# Altium project EDA-02267-V6-1_project.PrjPCB (part 2 of 3)

## Sheet power_supply.SchDoc: Fine Delay FMC
size 297 x 209 mm; CheckedBy: B. Civel; CompanyName: CERN; DrawnBy: TW, GK; Engineer: TW; Organization: CERN; Address1: European Organization for Nuclear Research; Address2: CH-1211 Geneve 23 - Switzerland; DocumentNumber: 5; Revision: -; SheetNumber: 5; SheetTotal: 10; ModifiedBy: B. Civel; CreateDate: 18/01/2012; CheckedDate: 06/06/2013; Title2: Power supply & supervisor; Designer: TW, GK; EDA_Number: EDA-02267-V6-1; Projet: Fine Delay FMC (FMCDel1ns4cha); DivGrp: BE-CO; ModifiedDate: 16/08/2012
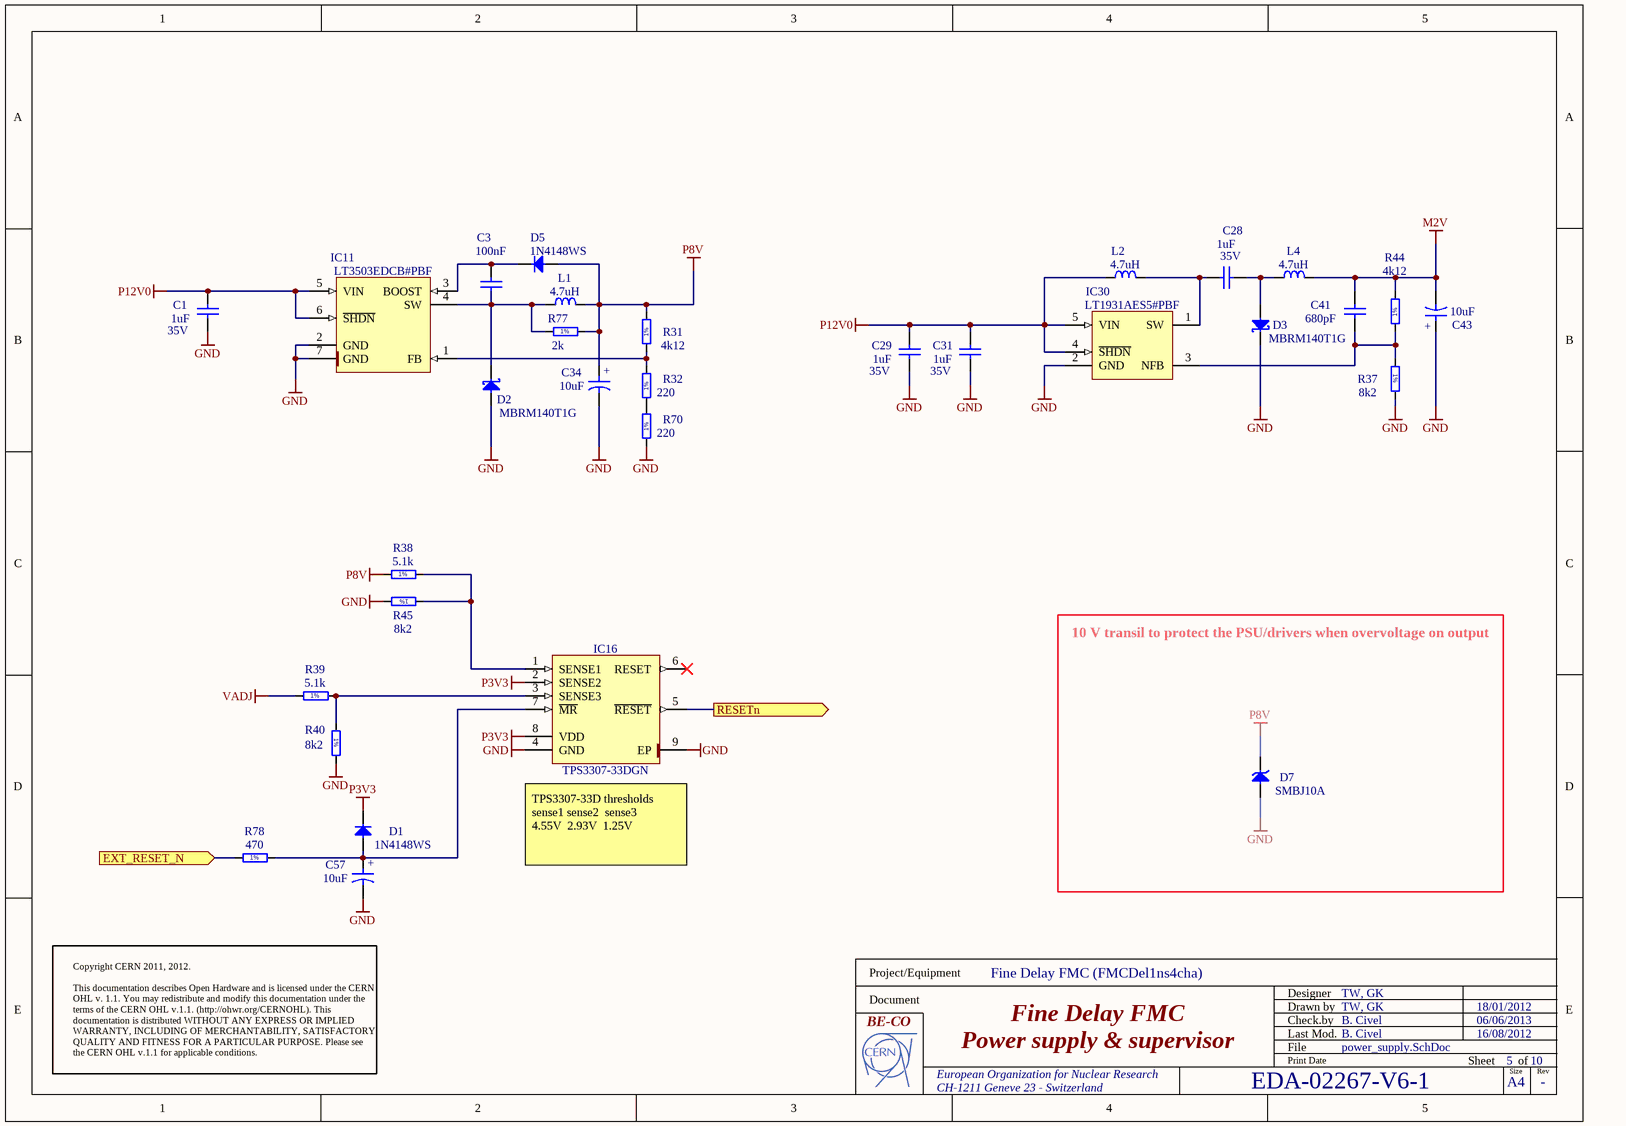
[diagram p3: power_supply.SchDoc]

### Parts
C1  1uF  Voltage: 35V  [CAPC2012X140N]
C3  100nF  [CAPC1608X87N]
C28  1uF  Voltage: 35V  [CAPC2012X140N]
C29  1uF  Voltage: 35V  [CAPC2012X140N]
C31  1uF  Voltage: 35V  [CAPC2012X140N]
C34  10uF  [CAPMP3528X210N]
C41  680pF  [CAPC1608X87N]
C43  10uF  [CAPMP3528X210N]
C57  10uF  [CAPMP3528X210N]
D1  1N4148WS  [SODFL2512X100N]
D2  MBRM140T1G  [ONSEMI_POWERMITE]
D3  MBRM140T1G  [ONSEMI_POWERMITE]
D5  1N4148WS  [SODFL2512X100N]
D7  SMBJ10A  [DIOM5336X265N]
IC11  LT3503EDCB#PBF  [SON50P300X200X80-7N-R175X145]
IC16  TPS3307-33DGN  [SOP65P490X110-9N-R157X189]
IC30  LT1931AES5#PBF  [SOT95P280X100-5N]
L1  4.7uH  [IND_TDK_VLCF5020-1]
L2  4.7uH  [IND_TDK_VLCF5020-1]
L4  4.7uH  [IND_TDK_VLCF5020-1]
R31  4k12  [RESC1608X55N]
R32  220  [RESC1608X55N]
R37  8k2  [RESC1608X55N]
R38  5.1k  [RESC1608X55N]
R39  5.1k  [RESC1608X55N]
R40  8k2  [RESC1608X55N]
R44  4k12  [RESC1608X55N]
R45  8k2  [RESC1608X55N]
R70  220  [RESC1608X55N]
R77  2k  [RESC1608X55N]
R78  470  [RESC1608X55N]

### Ports
EXT_RESET_N (in), RESETn (out)

### Nets
GND: C1.2 C29.2 C31.2 C34.2 C43.1 C57.2 D2.2(A) D3.1(C) D7.2(A) IC11.2(GND) IC11.7(GND) IC16.4(GND) IC16.9(EP) IC30.2(GND) R37.2 R40.2 R45.2 R70.1
M2V: C41.1 C43.2 L4.2 R44.2
P3V3: D1.1(C) IC16.2(SENSE2) IC16.8(VDD)
P8V: C34.1 D5.2(A) D7.1(C) L1.2 R31.2 R38.1 R77.2
P12V0: C1.1 C29.1 C31.1 IC11.5(VIN) IC11.6(~{SHDN}) IC30.4(~{SHDN}) IC30.5(VIN) L2.1
VADJ: R39.1
EXT_RESET_N: R78.1 ; port EXT_RESET_N
RESETn: IC16.5(~{RESET}) ; port RESETn
NetC3_1: C3.1 D2.1(C) IC11.4(SW) L1.1 R77.1
NetC3_2: C3.2 D5.1(C) IC11.3(BOOST)
NetC28_1: C28.1 D3.2(A) L4.1
NetC28_2: C28.2 IC30.1(SW) L2.2
NetC41_2: C41.2 IC30.3(NFB) R37.1 R44.1
NetC57_1: C57.1 D1.2(A) IC16.7(~{MR}) R78.2
NetIC11_1: IC11.1(FB) R31.1 R32.2
NetIC16_1: IC16.1(SENSE1) R38.2 R45.1
NetIC16_3: IC16.3(SENSE3) R39.2 R40.1
NetR32_1: R32.1 R70.2

Not connected (* = marked no-connect by the designer): IC16 6(RESET)*

### Notes on the sheet
- 10 V transil to protect the PSU/drivers when overvoltage on output
- (near IC16) TPS3307-33D thresholds
  sense1	sense2 	sense3
  4.55V 	2.93V 	1.25V
- Copyright CERN 2011, 2012.
  This documentation describes Open Hardware and is licensed under the CERN OHL v. 1.1. You may redistribute and modify this documentation under the terms of the CERN OHL v.1.1. (http://ohwr.org/CERNOHL). This documentation is distributed WITHOUT ANY EXPRESS OR IMPLIED WARRANTY, INCLUDING OF MERCHANTABILITY, SATISFACTORY QUALITY AND FITNESS FOR A PARTICULAR PURPOSE. Please see the CERN OHL v.1.1 for applicable conditions.
- Project/Equipment
- Document
- Designer
- Drawn by
- Check.by
- File
- Last Mod.
- Print Date
- Sheet
- Size
- A4
- of
- Rev
- (in symbol CTE3528-21_10UF_16V_20%_SANYO_TQC) +
- (in symbol R0603_2K_1%_0.1W_100PPM) 1%
- (in symbol R0603_4K12_1%_0.1W_100PPM) 1%
- (in symbol R0603_5K1_1%_0.1W_100PPM) 1%
- (in symbol R0603_8K2_1%_0.1W_100PPM) 1%
- (in symbol R0603_220R_1%_0.1W_100PPM) 1%
- (in symbol R0603_470R_1%_0.1W_100PPM) 1%

### Library data of the parts
C1 C28 C29 C31 = CC0805_1UF_35V_20%_X7R: Non-polarised capacitor; Part Description: SMD Multilayer Chip Ceramic Capacitor; Manufacturer: GENERIC; Manufacturer1 Part Number: GMK212B7105MG-T; TC: X7R; Tolerance: ±20%; Table: Capacitors SMD; Part Number: CC0805_1UF_35V_20%_X7R; Component Kind: Standard; Component Type: Standard; Pin Count: 2; Value: 1uF; Status: Not Recommended; Manufacturer Part Number: CC0805_1UF_35V_20%_X7R; Case: 0805; Mounted: Yes; Socket: No; SMD: Yes; Manufacturer1 Example: TAIYO YUDEN; Manufacturer1 ComponentHeight: 1.35mm; HelpURL: \\cern.ch\dfs\Applications\Altium\Datasheets\CC0805_X7R_TAIYO-YUDEN_HIGH-VALUE.pdf; Author: CERN DEM JLC; CreateDate: 22/06/2011; LatestRevisionDate: 22/06/2011
C3 = CC0603_100NF_50V_10%_X7R: as C12 on sheet clock_generator; Part Number: CC0603_100NF_50V_10%_X7R; Component Kind: Standard; Component Type: Standard; Pin Count: 2; Value: 100nF; Status: Preferred; Manufacturer Part Number: CC0603_100NF_50V_10%_X7R; Case: 0603; Mounted: Yes; Socket: No; SMD: Yes; Manufacturer1 Example: PHYCOMP; Manufacturer1 ComponentHeight: 0.87mm; HelpURL: \\cern.ch\dfs\Applications\Altium\Datasheets\CC0603_X7R_PHYCOMP.pdf; Author: CERN DEM JLC; CreateDate: 03/12/2007; LatestRevisionDate: 03/12/2007
C34 C43 C57 = CTE3528-21_10UF_16V_20%_SANYO_TQC: Polarised capacitor; Part Description: ESR 0R1 Solid Tantalum Chip Capacitor; Manufacturer: SANYO; Manufacturer Part Number: 16TQC10M; Voltage: 16V; Tolerance: ±20%; Table: Capacitors SMD; Part Number: CTE3528-21_10UF_16V_20%_SANYO_TQC; Component Kind: Standard; Component Type: Standard; Pin Count: 2; Value: 10uF; Status: Obsolete; Case: B; Mounted: Yes; Socket: No; SMD: Yes; ComponentHeight: 2.1mm; HelpURL: \\cern.ch\dfs\Applications\Altium\Datasheets\CTE_SANYO_TQC.pdf; Author: CERN DEM JLC; CreateDate: 29/06/2011; LatestRevisionDate: 01/09/2014
C41 = CC0603_680PF_50V_5%_NP0: Non-polarised capacitor; Part Description: SMD Multilayer Chip Ceramic Capacitor; Manufacturer: GENERIC; Manufacturer1 Part Number: 223886715681; Voltage: 50V; TC: C0G/NP0; Tolerance: ±5%; Table: Capacitors SMD; Part Number: CC0603_680PF_50V_5%_NP0; Component Kind: Standard; Component Type: Standard; Pin Count: 2; Value: 680pF; Status: Preferred; Manufacturer Part Number: CC0603_680PF_50V_5%_NP0; Case: 0603; Mounted: Yes; Socket: No; SMD: Yes; Manufacturer1 Example: PHYCOMP; Manufacturer1 ComponentHeight: 0.87mm; HelpURL: \\cern.ch\dfs\Applications\Altium\Datasheets\CC0603_NP0_PHYCOMP.pdf; Author: CERN DEM JLC; CreateDate: 03/12/2007; LatestRevisionDate: 03/12/2007
D1 D5 = 1N4148WS: Diode; Part Description: Small Signal Diodes; Manufacturer: FAIRCHILD SEMICONDUCTOR; Voltage: 75V; Power: 150mA; Table: Diodes; PressFit: No; Bonding: No; Part Number: 1N4148WS; Component Kind: Standard; Component Type: Standard; Device: 1N4148WS; PackageDescription: SODFL Diode; 1.70mm W X 1.25mm L X 1.00mm H body, IPC Medium Density; Manufacturer Part Number: 1N4148WS; Pin Count: 2; Case: SOD-323F; Mounted: Yes; Socket: No; SMD: Yes; ComponentHeight: 1mm; HelpURL: \\cern.ch\dfs\Applications\Altium\Datasheets\1N4148WS.pdf; Author: CERN DEM JLC; CreateDate: 12/05/2011; LatestRevisionDate: 12/05/2011
D2 D3 = MBRM140T1G: Schottky Diode; Part Description: Schottky Power Rectifier; Manufacturer: ON SEMICONDUCTOR; Voltage: 40V; Power: 1A; Table: Diodes; PressFit: No; Bonding: No; Part Number: MBRM140T1G; Component Kind: Standard; Component Type: Standard; Device: MBRM140T1G; PackageDescription: ON SEMICONDUCTOR POWERMITE Case, 2-Leads, Body 1.965 x 1.9mm; Manufacturer Part Number: MBRM140T1G; Pin Count: 2; Mounted: Yes; Socket: No; SMD: Yes; ComponentHeight: 1.15mm; HelpURL: \\cern.ch\dfs\Applications\Altium\Datasheets\MBRM140T1G.pdf; Author: CERN DEM JLC; CreateDate: 06/12/2011; LatestRevisionDate: 06/12/2011
D7 = SMBJ10A: Zener Diode; Part Description: Uni-Directional Transient Voltage Suppressor Diode; Manufacturer: FAIRCHILD SEMICONDUCTOR; Voltage: 10V; Power: 600W; Table: Diodes; PressFit: No; Bonding: No; Part Number: SMBJ10A; Component Kind: Standard; Component Type: Standard; Device: SMBJ10A; PackageDescription: DO-214-AA/SMB Diode, Molded Body; 5.34mm L X 3.625mm W X 2.65mm H, IPC Medium Density; Manufacturer Part Number: SMBJ10A; Pin Count: 2; Case: DO-214AA; Mounted: Yes; Socket: No; SMD: Yes; ComponentHeight: 2.65mm; HelpURL: \\cern.ch\dfs\Applications\Altium\Datasheets\SMBJ.pdf; Author: CERN DEM JLC; CreateDate: 19/12/2011; LatestRevisionDate: 19/12/2011
IC11 = LT3503EDCB#PBF: 1A, 2.2MHz Step-Down Switching Regulator; Manufacturer: LINEAR TECHNOLOGY; Table: Regulators; PressFit: No; Bonding: No; Part Number: LT3503EDCB#PBF; Component Kind: Standard; Component Type: Standard; Device: LT3503EDCB#PBF; PackageDescription: SON (DFN), 0.50mm pitch, 6 pin, 3mm X 2mm X 0.8mm H body (w/thermal tab 1.75 X 1.45mm),  IPC Medium Density; Part Description: 1A, 2.2MHz Step-Down Switching Regulator; Manufacturer Part Number: LT3503EDCB#PBF; Pin Count: 7; Case: SON6; Mounted: Yes; Socket: No; SMD: Yes; ComponentHeight: 0.8mm; HelpURL: \\cern.ch\dfs\Applications\Altium\Datasheets\LT3503EDCB#PBF.pdf; Author: CERN DEM JLC; CreateDate: 07/12/2011; LatestRevisionDate: 07/12/2011
IC16 = TPS3307-33DGN: Triple Processor Supervisors; Manufacturer: TEXAS INSTRUMENTS; Table: Analog & Interface; PressFit: No; Bonding: No; Part Number: TPS3307-33DGN; Component Kind: Standard; Component Type: Standard; Device: TPS3307-33DGN; PackageDescription: SOP,0.65mm,pitch; 8 pin,3.00mm W X 3.00mm L X 1.10mm H body (w/thermal tab 1.57 X 1.89 mm), IPC Medium Density; Part Description: Triple Processor Supervisors; Manufacturer Part Number: TPS3307-33DGN; Pin Count: 9; Case: TSSOP8; Mounted: Yes; Socket: No; SMD: Yes; ComponentHeight: 1.1mm; Author: CERN DEM JLC; HelpURL: \\cern.ch\dfs\Applications\Altium\Datasheets\TPS3307-33DGN.pdf; CreateDate: 10/01/2011; LatestRevisionDate: 10/01/2011
IC30 = LT1931AES5#PBF: 1.2MHz/2.2MHz Inverting DC/DC Converters in ThinSOT; Part Description: +16V to (-0.4V to -36V), 2.2MHz Inverting DC-DC Converters; Manufacturer: LINEAR TECHNOLOGY; Table: Regulators; PressFit: No; Bonding: No; Part Number: LT1931AES5#PBF; Component Kind: Standard; Component Type: Standard; Device: LT1931AES5#PBF; PackageDescription: SOT23, 0.95mm pitch; 5 pin, 1.6mm W X 2.9mm L, IPC Medium Density; Manufacturer Part Number: LT1931AES5#PBF; Pin Count: 5; Case: SOT23; Mounted: Yes; Socket: No; SMD: Yes; ComponentHeight: 1mm; HelpURL: \\cern.ch\dfs\Applications\Altium\Datasheets\LT1931AES5#PBF.pdf; Author: CERN DEM JLC; CreateDate: 01/02/2010; LatestRevisionDate: 18/04/2012
L1 L2 L4 = IND_4.7UH_30%_TDK_VLCF5020-1: Inductor; Part Description: SMD Inductor for Power Circuits (Wound/STD , Magnetic Shielded), VLCF series; Manufacturer: TDK; Manufacturer Part Number: VLCF5020T-4R7N1R7-1; Power: 2.09A; Resistance: 0.122R; Tolerance: ±30%; Table: Inductors SMD; Part Number: IND_4.7UH_30%_TDK_VLCF5020-1; Component Kind: Standard; Component Type: Standard; Pin Count: 2; Value: 4.7uH; Status: None; Mounted: Yes; Socket: No; SMD: Yes; ComponentHeight: 2mm; HelpURL: \\cern.ch\dfs\Applications\Altium\Datasheets\IND_TDK_VLCF.pdf; Author: CERN DEM JLC; CreateDate: 07/12/2011; LatestRevisionDate: 07/12/2011
R31 R44 = R0603_4K12_1%_0.1W_100PPM: Resistor - 1%; Part Description: General Purpose Thick Film Chip Resistor; Manufacturer: GENERIC; Manufacturer1 Part Number: RCW06034K12FKEA; Power: 0.1W; TC: ±100ppm/°C; Table: Resistors SMD; Part Number: R0603_4K12_1%_0.1W_100PPM; Component Kind: Standard; Component Type: Standard; Pin Count: 2; Value: 4k12; Status: Preferred; Tolerance: ±1%; Manufacturer Part Number: R0603_4K12_1%_0.1W_100PPM; Case: 0603; Mounted: Yes; Socket: No; SMD: Yes; Manufacturer1 Example: VISHAY; Manufacturer1 ComponentHeight: 0.55mm; HelpURL: \\cern.ch\dfs\Applications\Altium\Datasheets\R0603_VISHAY_CRCW e3.pdf; Author: CERN DEM JLC; CreateDate: 15/07/2010; LatestRevisionDate: 11/12/2013
R32 R70 = R0603_220R_1%_0.1W_100PPM: as R73 on sheet FMC_Delay_1ns_4Cha; Part Number: R0603_220R_1%_0.1W_100PPM; Component Kind: Standard; Component Type: Standard; Pin Count: 2; Value: 220; Status: Preferred; Tolerance: ±1%; Manufacturer Part Number: R0603_220R_1%_0.1W_100PPM; Case: 0603; Mounted: Yes; Socket: No; SMD: Yes; Manufacturer1 Example: NIC COMPONENT; Manufacturer1 ComponentHeight: 0.55mm; HelpURL: \\cern.ch\dfs\Applications\Altium\Datasheets\R0603_NIC_NRC.pdf; Author: CERN DEM JLC; CreateDate: 12/3/2007; LatestRevisionDate: 3/13/2008
R37 R40 R45 = R0603_8K2_1%_0.1W_100PPM: Resistor - 1%; Part Description: General Purpose Thick Film Chip Resistor; Manufacturer: GENERIC; Manufacturer1 Part Number: NRC06F8201TRF; Power: 0.1W; TC: ±100ppm/°C; Table: Resistors SMD; Part Number: R0603_8K2_1%_0.1W_100PPM; Component Kind: Standard; Component Type: Standard; Pin Count: 2; Value: 8k2; Status: Preferred; Tolerance: ±1%; Manufacturer Part Number: R0603_8K2_1%_0.1W_100PPM; Case: 0603; Mounted: Yes; Socket: No; SMD: Yes; Manufacturer1 Example: NIC COMPONENT; Manufacturer1 ComponentHeight: 0.55mm; HelpURL: \\cern.ch\dfs\Applications\Altium\Datasheets\R0603_NIC_NRC.pdf; Author: CERN DEM JLC; CreateDate: 12/3/2007; LatestRevisionDate: 3/13/2008
R38 R39 = R0603_5K1_1%_0.1W_100PPM: Resistor - 1%; Part Description: General Purpose Thick Film Chip Resistor; Manufacturer: GENERIC; Manufacturer1 Part Number: NRC06F5101TRF; Value: 5k1; Power: 0.1W; TC: ±100ppm/°C; Table: Resistors SMD; Part Number: R0603_5K1_1%_0.1W_100PPM; Component Kind: Standard; Component Type: Standard; Designator: Resistor - 1%; Library Reference: Resistor - 1%; Pin Count: 2; Status: Preferred; Tolerance: ±1%; Manufacturer Part Number: R0603_5K1_1%_0.1W_100PPM; Case: 0603; Mounted: Yes; Socket: No; SMD: Yes; Manufacturer1 Example: NIC COMPONENT; Manufacturer1 ComponentHeight: 0.55mm; HelpURL: \\cern.ch\dfs\Applications\Altium\Datasheets\R0603_NIC_NRC.pdf; Author: CERN DEM JLC; CreateDate: 12/3/2007; LatestRevisionDate: 3/13/2008
R77 = R0603_2K_1%_0.1W_100PPM: Resistor - 1%; Part Description: General Purpose Thick Film Chip Resistor; Manufacturer: GENERIC; Manufacturer1 Part Number: NRC06F2001TRF; Power: 0.1W; TC: ±100ppm/°C; Table: Resistors SMD; Part Number: R0603_2K_1%_0.1W_100PPM; Component Kind: Standard; Component Type: Standard; Pin Count: 2; Value: 2k; Status: Preferred; Tolerance: ±1%; Manufacturer Part Number: R0603_2K_1%_0.1W_100PPM; Case: 0603; Mounted: Yes; Socket: No; SMD: Yes; Manufacturer1 Example: NIC COMPONENT; Manufacturer1 ComponentHeight: 0.55mm; HelpURL: \\cern.ch\dfs\Applications\Altium\Datasheets\R0603_NIC_NRC.pdf; Author: CERN DEM JLC; CreateDate: 12/3/2007; LatestRevisionDate: 3/13/2008
R78 = R0603_470R_1%_0.1W_100PPM: Resistor - 1%; Part Description: General Purpose Thick Film Chip Resistor; Manufacturer: GENERIC; Manufacturer1 Part Number: NRC06F4700TRF; Power: 0.1W; TC: ±100ppm/°C; Table: Resistors SMD; Part Number: R0603_470R_1%_0.1W_100PPM; Component Kind: Standard; Component Type: Standard; Pin Count: 2; Value: 470; Status: Preferred; Tolerance: ±1%; Manufacturer Part Number: R0603_470R_1%_0.1W_100PPM; Case: 0603; Mounted: Yes; Socket: No; SMD: Yes; Manufacturer1 Example: NIC COMPONENT; Manufacturer1 ComponentHeight: 0.55mm; HelpURL: \\cern.ch\dfs\Applications\Altium\Datasheets\R0603_NIC_NRC.pdf; Author: CERN DEM JLC; CreateDate: 12/3/2007; LatestRevisionDate: 3/13/2008

## Sheet acam_tdc.SchDoc: Fine Delay FMC
size 297 x 209 mm; CheckedBy: B. Civel; CompanyName: CERN; DrawnBy: TW, GK; Engineer: TW; Organization: CERN; Address1: European Organization for Nuclear Research; Address2: CH-1211 Genève 23 - Switzerland; DocumentNumber: 7; Revision: -; SheetNumber: 7; SheetTotal: 10; ModifiedBy: B. Civel; CheckedDate: 06/06/2013; Title2: ACAM TDC + power supply; DivGrp: BE-CO; Designer: TW, GK; CreateDate: 01/01/2011; EDA_Number: EDA-02267-V6-1; Projet: Fine Delay FMC (FMCDel1ns4cha); ModifiedDate: 16/08/2012
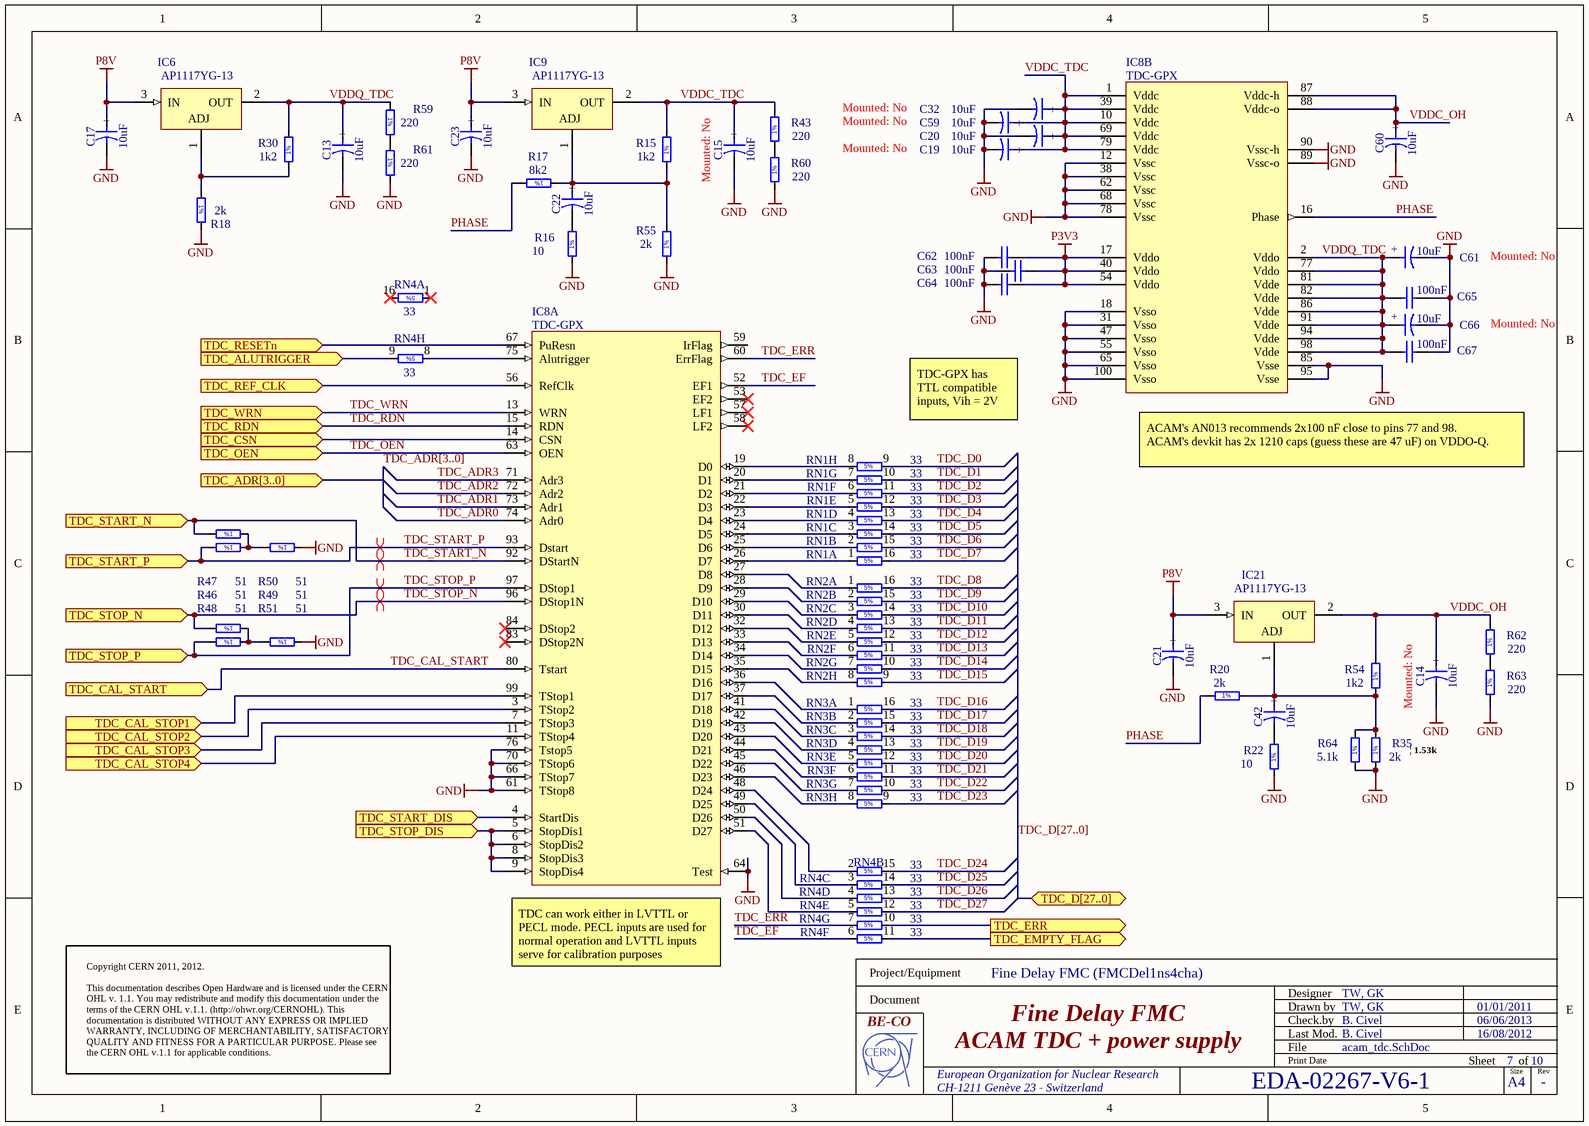
[diagram p4: acam_tdc.SchDoc]

### Parts
C13  10uF  [CAPMP3528X210N]
C14  10uF  Mounted: No  [CAPMP3528X210N]
C15  10uF  Mounted: No  [CAPMP3528X210N]
C17  10uF  [CAPMP3528X210N]
C19  10uF  Mounted: No  [CAPMP3528X210N]
C20  10uF  [CAPMP3528X210N]
C21  10uF  [CAPMP3528X210N]
C22  10uF  [CAPMP3528X210N]
C23  10uF  [CAPMP3528X210N]
C32  10uF  Mounted: No  [CAPMP3528X210N]
C42  10uF  [CAPMP3528X210N]
C59  10uF  Mounted: No  [CAPMP3528X210N]
C60  10uF  [CAPMP3528X210N]
C61  10uF  Mounted: No  [CAPMP3528X210N]
C62  100nF  [CAPC1608X87N]
C63  100nF  [CAPC1608X87N]
C64  100nF  [CAPC1608X87N]
C65  100nF  [CAPC1608X87N]
C66  10uF  Mounted: No  [CAPMP3528X210N]
C67  100nF  [CAPC1608X87N]
IC6  AP1117YG-13  [SOT89]
IC8  TDC-GPX  [QFP50P1600X1600X120-100N]  (parts A,B of 2)
IC9  AP1117YG-13  [SOT89]
IC21  AP1117YG-13  [SOT89]
R15  1k2  [RESC1608X55N]
R16  10  [RESC1608X55N]
R17  8k2  [RESC1608X55N]
R18  2k  [RESC1608X55N]
R20  2k  [RESC1608X55N]
R22  10  [RESC1608X55N]
R30  1k2  [RESC1608X55N]
R35  2k  [RESC1608X55N]
R43  220  [RESC1608X55N]
R46  51  [RESC1608X55N]
R47  51  [RESC1608X55N]
R48  51  [RESC1608X55N]
R49  51  [RESC1608X55N]
R50  51  [RESC1608X55N]
R51  51  [RESC1608X55N]
R54  1k2  [RESC1608X55N]
R55  2k  [RESC1608X55N]
R59  220  [RESC1608X55N]
R60  220  [RESC1608X55N]
R61  220  [RESC1608X55N]
R62  220  [RESC1608X55N]
R63  220  [RESC1608X55N]
R64  5.1k  [RESC1608X55N]
RN1  33  [RN_YAGEO_YC248]  (parts A,B,C,D,E,F,G,H of 8)
RN2  33  [RN_YAGEO_YC248]  (parts A,B,C,D,E,F,G,H of 8)
RN3  33  [RN_YAGEO_YC248]  (parts A,B,C,D,E,F,G,H of 8)
RN4  33  [RN_YAGEO_YC248]  (parts A,B,C,D,E,F,G,H of 8)

### Ports
TDC_ADR[3..0] (in), TDC_ALUTRIGGER (in), TDC_CAL_START (in), TDC_CAL_STOP1 (in), TDC_CAL_STOP2 (in), TDC_CAL_STOP3 (in), TDC_CAL_STOP4 (in), TDC_CSN (in), TDC_D[27..0] (bidir), TDC_EMPTY_FLAG (out), TDC_ERR (out), TDC_OEN (in), TDC_RDN (in), TDC_REF_CLK (in), TDC_RESETn (in), TDC_START_DIS (in), TDC_START_N (in), TDC_START_P (in), TDC_STOP_DIS (in), TDC_STOP_N (in), TDC_STOP_P (in), TDC_WRN (in)

### Nets
GND: C13.2 C14.2 C15.2 C17.2 C19.2 C20.2 C21.2 C23.2 C32.2 C59.2 C60.2 C61.2 C62.2 C63.1 C64.1 C65.2 C66.2 C67.2 IC8.12(Vssc) IC8.14(CSN) IC8.18(Vsso) IC8.31(Vsso) IC8.38(Vssc) IC8.47(Vsso) IC8.55(Vsso) IC8.61(TStop8) IC8.62(Vssc) IC8.64(Test) IC8.65(Vsso) IC8.66(TStop7) IC8.68(Vssc) IC8.70(TStop6) IC8.76(Tstop5) IC8.78(Vssc) IC8.85(Vsse) IC8.89(Vssc-o) IC8.90(Vssc-h) IC8.95(Vsse) IC8.100(Vsso) R16.1 R18.2 R22.1 R35.1 R48.1 R51.1 R55.1 R60.1 R61.2 R63.1 R64.1 ; port TDC_CSN
P3V3: C62.1 C63.2 C64.2 IC8.17(Vddo) IC8.40(Vddo) IC8.54(Vddo)
P8V: C17.1 C21.1 C23.1 IC6.3(IN) IC9.3(IN) IC21.3(IN)
PHASE: IC8.16(Phase) R17.2 R20.1
RESETn: IC8.67(PuResn) ; port TDC_RESETn
TDC_ADR0: IC8.74(Adr0)
TDC_ADR1: IC8.73(Adr1)
TDC_ADR2: IC8.72(Adr2)
TDC_ADR3: IC8.71(Adr3)
TDC_CAL_START: IC8.80(Tstart) ; port TDC_CAL_START  [project net CAL_PULSE_BUF]
TDC_CAL_STOP1: IC8.99(TStop1) ; port TDC_CAL_STOP1
TDC_CAL_STOP2: IC8.3(TStop2) ; port TDC_CAL_STOP2
TDC_CAL_STOP3: IC8.7(TStop3) ; port TDC_CAL_STOP3
TDC_CAL_STOP4: IC8.11(TStop4) ; port TDC_CAL_STOP4
TDC_D0: RN1.9
TDC_D1: RN1.10
TDC_D2: RN1.11
TDC_D3: RN1.12
TDC_D4: RN1.13
TDC_D5: RN1.14
TDC_D6: RN1.15
TDC_D7: RN1.16
TDC_D8: RN2.16
TDC_D9: RN2.15
TDC_D10: RN2.14
TDC_D11: RN2.13
TDC_D12: RN2.12
TDC_D13: RN2.11
TDC_D14: RN2.10
TDC_D15: RN2.9
TDC_D16: RN3.16
TDC_D17: RN3.15
TDC_D18: RN3.14
TDC_D19: RN3.13
TDC_D20: RN3.12
TDC_D21: RN3.11
TDC_D22: RN3.10
TDC_D23: RN3.9
TDC_D24: RN4.15
TDC_D25: RN4.14
TDC_D26: RN4.13
TDC_D27: RN4.12
TDC_EF: IC8.52(EF1) RN4.6
TDC_ERR: IC8.60(ErrFlag) RN4.7
TDC_OEN: IC8.63(OEN) ; port TDC_OEN
TDC_RDN: IC8.15(RDN) ; port TDC_RDN
TDC_START_N: IC8.92(DStartN) R50.2 ; port TDC_START_N
TDC_START_P: IC8.93(Dstart) R49.2 ; port TDC_START_P
TDC_STOP_N: IC8.96(DStop1N) R47.2 ; port TDC_STOP_N
TDC_STOP_P: IC8.97(DStop1) R46.2 ; port TDC_STOP_P
TDC_WRN: IC8.13(WRN) ; port TDC_WRN
VDDC_OH: C14.1 C60.1 IC8.87(Vddc-h) IC8.88(Vddc-o) IC21.2(OUT) R54.2 R62.2
VDDC_TDC: C15.1 C19.1 C20.1 C32.1 C59.1 IC8.1(Vddc) IC8.10(Vddc) IC8.39(Vddc) IC8.69(Vddc) IC8.79(Vddc) IC9.2(OUT) R15.2 R43.2
VDDQ_TDC: C13.1 C61.1 C65.1 C66.1 C67.1 IC6.2(OUT) IC8.2(Vddo) IC8.77(Vddo) IC8.81(Vdde) IC8.82(Vdde) IC8.86(Vdde) IC8.91(Vdde) IC8.94(Vdde) IC8.98(Vdde) R30.2 R59.1
NetC22_1: C22.1 IC9.1(ADJ) R15.1 R17.1 R55.2
NetC22_2: C22.2 R16.2
NetC42_1: C42.1 IC21.1(ADJ) R20.2 R35.2 R54.1 R64.2
NetC42_2: C42.2 R22.2
NetIC4_46: IC8.56(RefClk) ; port TDC_REF_CLK
NetIC6_1: IC6.1(ADJ) R18.1 R30.1
NetIC8_4: IC8.4(StartDis) ; port TDC_START_DIS
NetIC8_5: IC8.5(StopDis1) IC8.6(StopDis2) IC8.8(StopDis3) IC8.9(StopDis4) ; port TDC_STOP_DIS
NetIC8_19: IC8.19(D0) RN1.8
NetIC8_20: IC8.20(D1) RN1.7
NetIC8_21: IC8.21(D2) RN1.6
NetIC8_22: IC8.22(D3) RN1.5
NetIC8_23: IC8.23(D4) RN1.4
NetIC8_24: IC8.24(D5) RN1.3
NetIC8_25: IC8.25(D6) RN1.2
NetIC8_26: IC8.26(D7) RN1.1
NetIC8_27: IC8.27(D8) RN2.1
NetIC8_28: IC8.28(D9) RN2.2
NetIC8_29: IC8.29(D10) RN2.3
NetIC8_30: IC8.30(D11) RN2.4
NetIC8_32: IC8.32(D12) RN2.5
NetIC8_33: IC8.33(D13) RN2.6
NetIC8_34: IC8.34(D14) RN2.7
NetIC8_35: IC8.35(D15) RN2.8
NetIC8_36: IC8.36(D16) RN3.1
NetIC8_37: IC8.37(D17) RN3.2
NetIC8_41: IC8.41(D18) RN3.3
NetIC8_42: IC8.42(D19) RN3.4
NetIC8_43: IC8.43(D20) RN3.5
NetIC8_44: IC8.44(D21) RN3.6
NetIC8_45: IC8.45(D22) RN3.7
NetIC8_46: IC8.46(D23) RN3.8
NetIC8_48: IC8.48(D24) RN4.2
NetIC8_49: IC8.49(D25) RN4.3
NetIC8_50: IC8.50(D26) RN4.4
NetIC8_51: IC8.51(D27) RN4.5
NetIC8_75: IC8.75(Alutrigger) RN4.8
NetJ6_g18: RN4.9 ; port TDC_ALUTRIGGER
NetJ6_g19: RN4.11 ; port TDC_EMPTY_FLAG
NetR43_1: R43.1 R60.2
NetR46_1: R46.1 R47.1 R48.2
NetR49_1: R49.1 R50.1 R51.2
NetR59_2: R59.2 R61.1
NetR62_1: R62.1 R63.2
NetRN4_10: RN4.10 ; port TDC_ERR

Not connected (* = marked no-connect by the designer): IC8 53(EF2)* 57(LF1)* 58(LF2)* 59(IrFlag) 83(DStop2N)* 84(DStop2)*; RN4 1* 16*

### Buses and harness runs
bus TDC_ADR[3..0] = port TDC_ADR[3..0]
bus TDC_D[27..0] = port TDC_D[27..0]

### Layout directives
differential pair: TDC_START_N, TDC_START_P, TDC_STOP_N, TDC_STOP_P

### Notes on the sheet
- TDC-GPX has TTL compatible inputs, Vih = 2V
- (near IC8) ACAM's AN013 recommends 2x100 nF close to pins 77 and 98.
  ACAM's devkit has 2x 1210 caps (guess these are 47 uF) on VDDO-Q.
- | 1.53k
- (near IC8) TDC can work either in LVTTL or PECL mode. PECL inputs are used for normal operation and LVTTL inputs serve for calibration purposes
- Copyright CERN 2011, 2012.
  This documentation describes Open Hardware and is licensed under the CERN OHL v. 1.1. You may redistribute and modify this documentation under the terms of the CERN OHL v.1.1. (http://ohwr.org/CERNOHL). This documentation is distributed WITHOUT ANY EXPRESS OR IMPLIED WARRANTY, INCLUDING OF MERCHANTABILITY, SATISFACTORY QUALITY AND FITNESS FOR A PARTICULAR PURPOSE. Please see the CERN OHL v.1.1 for applicable conditions.
- Project/Equipment
- Document
- Designer
- Drawn by
- Check.by
- File
- Last Mod.
- Print Date
- Sheet
- Size
- A4
- of
- Rev
- (in symbol CTE3528-21_10UF_16V_20%_SANYO_TQC) +
- (in symbol R0603_1K2_1%_0.1W_100PPM) 1%
- (in symbol R0603_2K_1%_0.1W_100PPM) 1%
- (in symbol R0603_5K1_1%_0.1W_100PPM) 1%
- (in symbol R0603_8K2_1%_0.1W_100PPM) 1%
- (in symbol R0603_10R_1%_0.1W_200PPM) 1%
- (in symbol R0603_51R_1%_0.1W_100PPM) 1%
- (in symbol R0603_220R_1%_0.1W_100PPM) 1%
- (in symbol RN_33R_YAGEO_YC248-JR-0733RL, part A) 5%
- (in symbol RN_33R_YAGEO_YC248-JR-0733RL, part B) 5%
- (in symbol RN_33R_YAGEO_YC248-JR-0733RL, part C) 5%
- (in symbol RN_33R_YAGEO_YC248-JR-0733RL, part D) 5%
- (in symbol RN_33R_YAGEO_YC248-JR-0733RL, part E) 5%
- (in symbol RN_33R_YAGEO_YC248-JR-0733RL, part F) 5%
- (in symbol RN_33R_YAGEO_YC248-JR-0733RL, part G) 5%
- (in symbol RN_33R_YAGEO_YC248-JR-0733RL, part H) 5%

### Library data of the parts
C13-C15 C17 C19-C23 C32 C42 C59-C61 C66 = CTE3528-21_10UF_16V_20%_SANYO_TQC: as C34 on sheet power_supply; Part Number: CTE3528-21_10UF_16V_20%_SANYO_TQC; Component Kind: Standard; Component Type: Standard; Pin Count: 2; Value: 10uF; Status: Obsolete; Case: B; Socket: No; SMD: Yes; ComponentHeight: 2.1mm; HelpURL: \\cern.ch\dfs\Applications\Altium\Datasheets\CTE_SANYO_TQC.pdf; Author: CERN DEM JLC; CreateDate: 29/06/2011; LatestRevisionDate: 01/09/2014
  C13 C17 C20-C23 C42 C60: Mounted: Yes
C62-C65 C67 = CC0603_100NF_50V_10%_X7R: as C70 on sheet FMC_Delay_1ns_4Cha; Author: CERN DEM JLC; Case: 0603; Component Type: Standard; CreateDate: 03/12/2007; HelpURL: \\cern.ch\dfs\Applications\Altium\Datasheets\CC0603_X7R_PHYCOMP.pdf; LatestRevisionDate: 03/12/2007; Manufacturer1 ComponentHeight: 0.87mm; Manufacturer1 Example: PHYCOMP; Manufacturer Part Number: CC0603_100NF_50V_10%_X7R; Mounted: Yes; Pin Count: 2; SMD: Yes; Socket: No; Status: Preferred; Value: 100nF; Part Number: CC0603_100NF_50V_10%_X7R; Component Kind: Standard
IC6 IC9 IC21 = AP1117YG-13: 3-Terminal Regulator 1=Adj 2=OUT 3=IN; Part Description: 1.25V To 5V, 1A Low-Dropout Positive Adjustable Voltage Regulator; Manufacturer: DIODES INCORPORATED; Table: Regulators; PressFit: No; Bonding: No; Part Number: AP1117YG-13; Component Kind: Standard; Component Type: Standard; Device: AP1117YG-13; PackageDescription: SOT89-3, 3-Leads, Body 2.48x4.5mm; Manufacturer Part Number: AP1117YG-13; Pin Count: 3; Case: SOT89; Mounted: Yes; Socket: No; SMD: Yes; ComponentHeight: 1.6mm; HelpURL: \\cern.ch\dfs\Applications\Altium\Datasheets\AP1117YG-13.pdf; Author: CERN DEM JLC; CreateDate: 04/05/2011; LatestRevisionDate: 04/05/2011
IC8 = TDC-GPX: Multifunctional High-End Time-to-Digital Converter (4 different operation modes, 81 ps up to 10 ps resolution); Manufacturer: ACAM MESS-ELECTRONIC; Table: Analog & Interface; PressFit: No; Bonding: No; Part Number: TDC-GPX; Component Kind: Standard; Component Type: Standard; Device: TDC-GPX; PackageDescription: QFP,0.50mm pitch,square;100 pin,14.00mm L X 14.00mm W X 1.20mm H body (w/thermal tab), IPC Medium Density; Part Description: Multifunctional High-End Time-to-Digital Converter (4 different operation modes, 81 ps up to 10 ps resolution); Manufacturer Part Number: TDC-GPX; Pin Count: 100; Case: QFP100; Mounted: Yes; Socket: No; SMD: Yes; ComponentHeight: 1.2mm; Author: CERN DEM JLC; HelpURL: \\cern.ch\dfs\Applications\Altium\Datasheets\TDC-GPX.pdf; CreateDate: 05/07/2010; LatestRevisionDate: 05/07/2010
R15 R30 R54 = R0603_1K2_1%_0.1W_100PPM: Resistor - 1%; Part Description: General Purpose Thick Film Chip Resistor; Manufacturer: GENERIC; Manufacturer1 Part Number: NRC06F1201TRF; Power: 0.1W; TC: ±100ppm/°C; Table: Resistors SMD; Part Number: R0603_1K2_1%_0.1W_100PPM; Component Kind: Standard; Component Type: Standard; Pin Count: 2; Value: 1k2; Status: Preferred; Tolerance: ±1%; Manufacturer Part Number: R0603_1K2_1%_0.1W_100PPM; Case: 0603; Mounted: Yes; Socket: No; SMD: Yes; Manufacturer1 Example: NIC COMPONENT; Manufacturer1 ComponentHeight: 0.55mm; HelpURL: \\cern.ch\dfs\Applications\Altium\Datasheets\R0603_NIC_NRC.pdf; Author: CERN DEM JLC; CreateDate: 12/3/2007; LatestRevisionDate: 3/13/2008
R16 R22 = R0603_10R_1%_0.1W_200PPM: Resistor - 1%; Part Description: General Purpose Thick Film Chip Resistor; Manufacturer: GENERIC; Manufacturer1 Part Number: NRC06F10R0TRF; Power: 0.1W; TC: ±200ppm/°C; Table: Resistors SMD; Part Number: R0603_10R_1%_0.1W_200PPM; Component Kind: Standard; Component Type: Standard; Pin Count: 2; Value: 10; Status: Preferred; Tolerance: ±1%; Manufacturer Part Number: R0603_10R_1%_0.1W_200PPM; Case: 0603; Mounted: Yes; Socket: No; SMD: Yes; Manufacturer1 Example: NIC COMPONENT; Manufacturer1 ComponentHeight: 0.55mm; HelpURL: \\cern.ch\dfs\Applications\Altium\Datasheets\R0603_NIC_NRC.pdf; Author: CERN DEM JLC; CreateDate: 12/3/2007; LatestRevisionDate: 6/24/2009
R17 = R0603_8K2_1%_0.1W_100PPM: as R37 on sheet power_supply; Part Number: R0603_8K2_1%_0.1W_100PPM; Component Kind: Standard; Component Type: Standard; Pin Count: 2; Value: 8k2; Status: Preferred; Tolerance: ±1%; Manufacturer Part Number: R0603_8K2_1%_0.1W_100PPM; Case: 0603; Mounted: Yes; Socket: No; SMD: Yes; Manufacturer1 Example: NIC COMPONENT; Manufacturer1 ComponentHeight: 0.55mm; HelpURL: \\cern.ch\dfs\Applications\Altium\Datasheets\R0603_NIC_NRC.pdf; Author: CERN DEM JLC; CreateDate: 12/3/2007; LatestRevisionDate: 3/13/2008
R18 R20 R35 R55 = R0603_2K_1%_0.1W_100PPM: as R77 on sheet power_supply; Part Number: R0603_2K_1%_0.1W_100PPM; Component Kind: Standard; Component Type: Standard; Pin Count: 2; Value: 2k; Status: Preferred; Tolerance: ±1%; Manufacturer Part Number: R0603_2K_1%_0.1W_100PPM; Case: 0603; Mounted: Yes; Socket: No; SMD: Yes; Manufacturer1 Example: NIC COMPONENT; Manufacturer1 ComponentHeight: 0.55mm; HelpURL: \\cern.ch\dfs\Applications\Altium\Datasheets\R0603_NIC_NRC.pdf; Author: CERN DEM JLC; CreateDate: 12/3/2007; LatestRevisionDate: 3/13/2008
R43 R59-R63 = R0603_220R_1%_0.1W_100PPM: as R73 on sheet FMC_Delay_1ns_4Cha; Part Number: R0603_220R_1%_0.1W_100PPM; Component Kind: Standard; Component Type: Standard; Pin Count: 2; Value: 220; Status: Preferred; Tolerance: ±1%; Manufacturer Part Number: R0603_220R_1%_0.1W_100PPM; Case: 0603; Mounted: Yes; Socket: No; SMD: Yes; Manufacturer1 Example: NIC COMPONENT; Manufacturer1 ComponentHeight: 0.55mm; HelpURL: \\cern.ch\dfs\Applications\Altium\Datasheets\R0603_NIC_NRC.pdf; Author: CERN DEM JLC; CreateDate: 12/3/2007; LatestRevisionDate: 3/13/2008
R46-R51 = R0603_51R_1%_0.1W_100PPM: as R68 on sheet FMC_Delay_1ns_4Cha; Part Number: R0603_51R_1%_0.1W_100PPM; Component Kind: Standard; Component Type: Standard; Pin Count: 2; Value: 51; Status: Preferred; Tolerance: ±1%; Manufacturer Part Number: R0603_51R_1%_0.1W_100PPM; Case: 0603; Mounted: Yes; Socket: No; SMD: Yes; Manufacturer1 Example: NIC COMPONENT; Manufacturer1 ComponentHeight: 0.55mm; HelpURL: \\cern.ch\dfs\Applications\Altium\Datasheets\R0603_NIC_NRC.pdf; Author: CERN DEM JLC; CreateDate: 12/3/2007; LatestRevisionDate: 3/13/2008
R64 = R0603_5K1_1%_0.1W_100PPM: as R38 on sheet power_supply; Part Number: R0603_5K1_1%_0.1W_100PPM; Component Kind: Standard; Component Type: Standard; Designator: Resistor - 1%; Library Reference: Resistor - 1%; Pin Count: 2; Status: Preferred; Tolerance: ±1%; Manufacturer Part Number: R0603_5K1_1%_0.1W_100PPM; Case: 0603; Mounted: Yes; Socket: No; SMD: Yes; Manufacturer1 Example: NIC COMPONENT; Manufacturer1 ComponentHeight: 0.55mm; HelpURL: \\cern.ch\dfs\Applications\Altium\Datasheets\R0603_NIC_NRC.pdf; Author: CERN DEM JLC; CreateDate: 12/3/2007; LatestRevisionDate: 3/13/2008
RN1-RN4 = RN_33R_YAGEO_YC248-JR-0733RL: DIL16 Resistor Network 8 Isolated Resistor 5%; Part Description: Chip Resistor Array , 8 Isolated Resistors (Side Convex Terminal), YC248 Series; Manufacturer: YAGEO; Power: 0.062W; TC: ±200ppm/°C; Table: Resistor Networks SMD; Part Number: RN_33R_YAGEO_YC248-JR-0733RL; Component Kind: Standard; Component Type: Standard; Pin Count: 16; Value: 33; Tolerance: ±5%; Manufacturer Part Number: YC248-JR-0733RL; Mounted: Yes; Socket: No; SMD: Yes; ComponentHeight: 0.55mm; HelpURL: \\cern.ch\dfs\Applications\Altium\Datasheets\RN_YAGEO_YC248.pdf; Author: CERN DEM JLC; CreateDate: 13/01/2011; LatestRevisionDate: 13/01/2011

## Sheet delay_channel.SchDoc: Fine Delay FMC
size 297 x 209 mm; CheckedBy: B. Civel; CompanyName: CERN; DrawnBy: TW, GK; Engineer: TW; Organization: CERN; Address1: European Organization for Nuclear Research; Address2: CH-1211 Geneve 23 - Switzerland; DocumentNumber: 8; Revision: -; SheetNumber: 8; SheetTotal: 10; ModifiedBy: B. Civel; CreateDate: 13/07/2011; CheckedDate: 06/06/2013; Title2: Programmable delay line; DivGrp: BE-CO; Designer: TW, GK; Projet: Fine Delay FMC (FMCDel1ns4cha); EDA_Number: EDA-02267-V6-0; ModifiedDate: 16/08/2012
Used 2 times, as channels U_CHANNEL_DELAY, U_CHANNEL_DELAY. Parts and nets are listed once, with the designators drawn on the sheet.
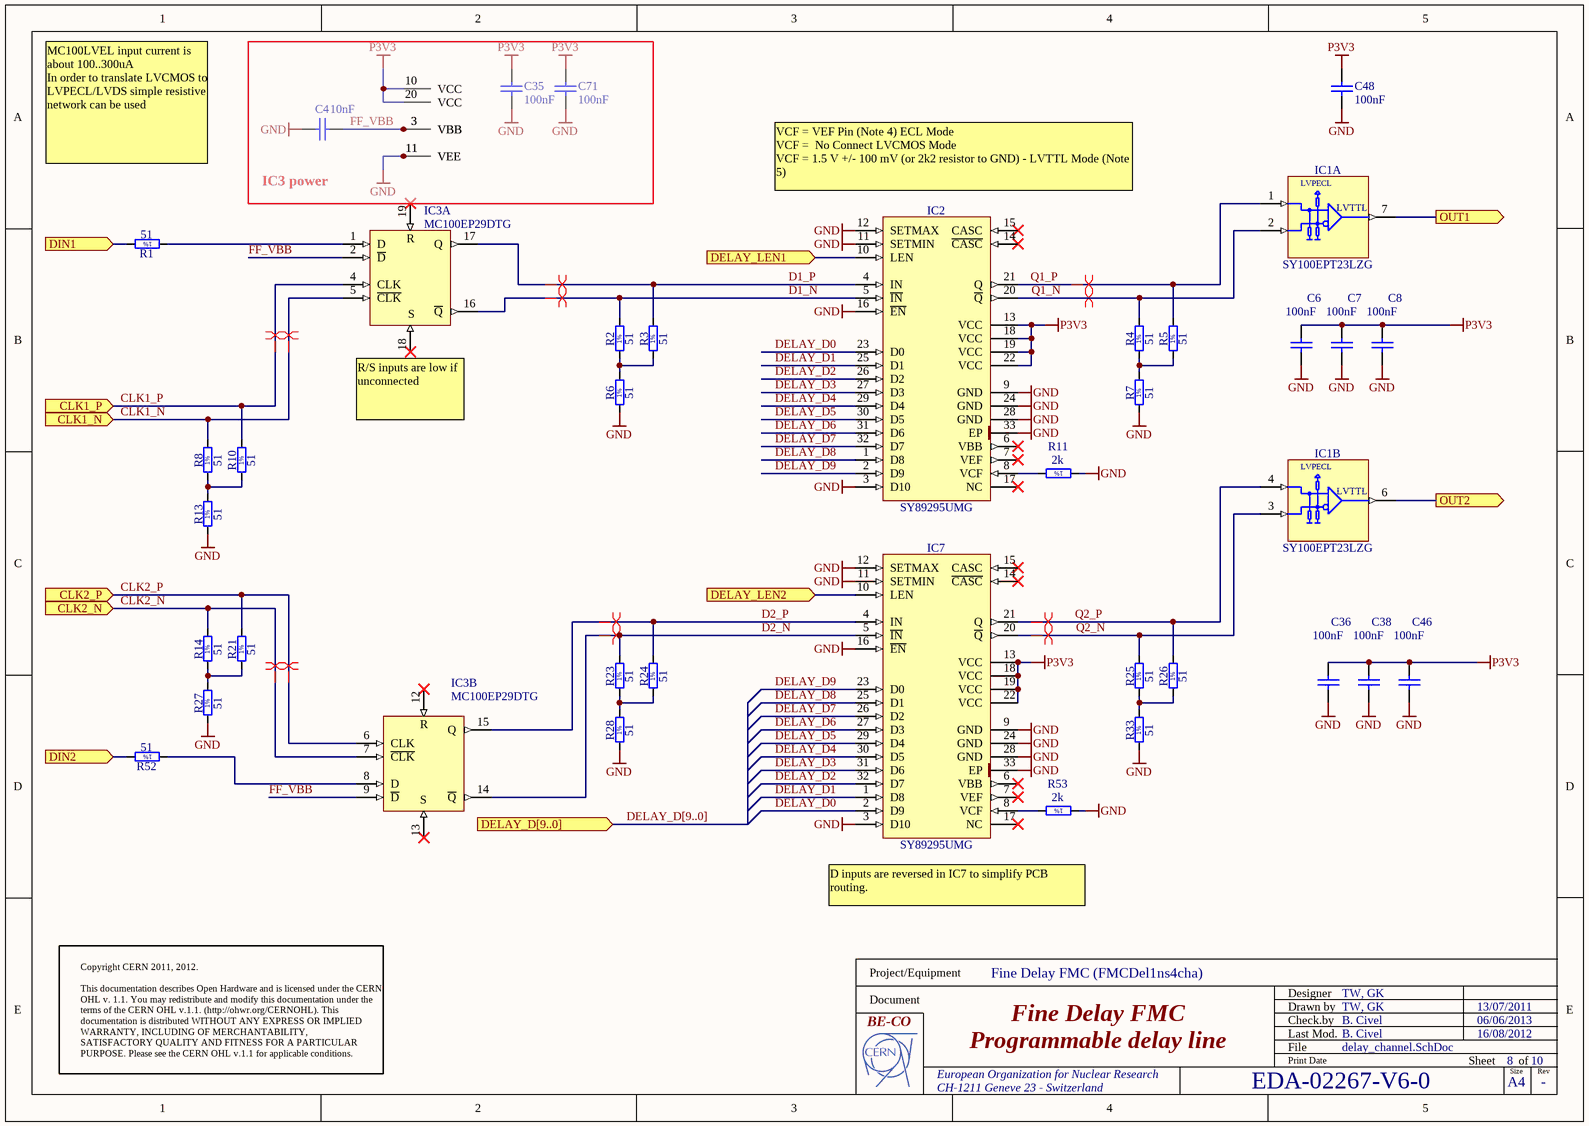
[diagram p5: delay_channel.SchDoc]

### Parts
C4  10nF  [CAPC1608X87N]
C6  100nF  [CAPC1608X87N]
C7  100nF  [CAPC1608X87N]
C8  100nF  [CAPC1608X87N]
C35  100nF  [CAPC1608X87N]
C36  100nF  [CAPC1608X87N]
C38  100nF  [CAPC1608X87N]
C46  100nF  [CAPC1608X87N]
C48  100nF  [CAPC1608X87N]
C71  100nF  [CAPC1608X87N]
IC1  SY100EPT23LZG  [SOIC127P600X175-8N]  (parts A,B of 2)
IC2  SY89295UMG  [QFN50P500X500X90-33N-S320]
IC3  MC100EP29DTG  [SOP65P640X120-20N]  (parts A,B of 2)
IC7  SY89295UMG  [QFN50P500X500X90-33N-S320]
R1  51  [RESC1608X55N]
R2  51  [RESC1608X55N]
R3  51  [RESC1608X55N]
R4  51  [RESC1608X55N]
R5  51  [RESC1608X55N]
R6  51  [RESC1608X55N]
R7  51  [RESC1608X55N]
R8  51  [RESC1608X55N]
R10  51  [RESC1608X55N]
R11  2k  [RESC1608X55N]
R13  51  [RESC1608X55N]
R14  51  [RESC1608X55N]
R21  51  [RESC1608X55N]
R23  51  [RESC1608X55N]
R24  51  [RESC1608X55N]
R25  51  [RESC1608X55N]
R26  51  [RESC1608X55N]
R27  51  [RESC1608X55N]
R28  51  [RESC1608X55N]
R33  51  [RESC1608X55N]
R52  51  [RESC1608X55N]
R53  2k  [RESC1608X55N]

### Blocks framed on the sheet
IC3 power: C4 C35 C71

### Ports
CLK1_N (in), CLK1_P (in), CLK2_N (in), CLK2_P (in), DELAY_D[9..0] (in), DELAY_LEN1 (in), DELAY_LEN2 (in), DIN1 (in), DIN2 (in), OUT1 (out), OUT2 (out)

### Nets
GND: C4.2 C6.2 C7.2 C8.2 C35.1 C36.2 C38.2 C46.2 C48.2 C71.1 IC1.5(GND) IC2.3(D10) IC2.9(GND) IC2.11(SETMIN) IC2.12(SETMAX) IC2.16(~{EN}) IC2.24(GND) IC2.28(GND) IC2.33(EP) IC3.11(VEE) IC7.3(D10) IC7.9(GND) IC7.11(SETMIN) IC7.12(SETMAX) IC7.16(~{EN}) IC7.24(GND) IC7.28(GND) IC7.33(EP) R6.1 R7.1 R11.1 R13.1 R27.1 R28.1 R33.1 R53.1
P3V3: C6.1 C7.1 C8.1 C35.2 C36.1 C38.1 C46.1 C48.1 C71.2 IC1.8(VCC) IC2.13(VCC) IC2.18(VCC) IC2.19(VCC) IC2.22(VCC) IC3.10(VCC) IC3.20(VCC) IC7.13(VCC) IC7.18(VCC) IC7.19(VCC) IC7.22(VCC)
CLK1_N: IC3.5(~{CLK}) R8.2 ; port CLK1_N
CLK1_P: IC3.4(CLK) R10.2 ; port CLK1_P
CLK2_N: IC3.7(~{CLK}) R14.2 ; port CLK2_N
CLK2_P: IC3.6(CLK) R21.2 ; port CLK2_P
D1_N: IC2.5(~{IN}) IC3.16(~{Q}) R2.2
D1_P: IC2.4(IN) IC3.17(Q) R3.2
D2_N: IC3.14(~{Q}) IC7.5(~{IN}) R23.2
D2_P: IC3.15(Q) IC7.4(IN) R24.2
DELAY_D0: IC2.23(D0) IC7.2(D9)
DELAY_D1: IC2.25(D1) IC7.1(D8)
DELAY_D2: IC2.26(D2) IC7.32(D7)
DELAY_D3: IC2.27(D3) IC7.31(D6)
DELAY_D4: IC2.29(D4) IC7.30(D5)
DELAY_D5: IC2.30(D5) IC7.29(D4)
DELAY_D6: IC2.31(D6) IC7.27(D3)
DELAY_D7: IC2.32(D7) IC7.26(D2)
DELAY_D8: IC2.1(D8) IC7.25(D1)
DELAY_D9: IC2.2(D9) IC7.23(D0)
DELAY_LEN1: IC2.10(LEN) ; port DELAY_LEN1
DELAY_LEN2: IC7.10(LEN) ; port DELAY_LEN2
DIN1: R1.2 ; port DIN1
DIN2: R52.2 ; port DIN2
FF_VBB: C4.1 IC3.2(~{D}) IC3.3(VBB) IC3.9(~{D})
OUT1: IC1.7(Q0) ; port OUT1
OUT2: IC1.6(Q0) ; port OUT2
Q1_N: IC1.2(~{D0}) IC2.20(~{Q}) R4.2
Q1_P: IC1.1(D0) IC2.21(Q) R5.2
Q2_N: IC1.3(~{D0}) IC7.20(~{Q}) R25.2
Q2_P: IC1.4(D0) IC7.21(Q) R26.2
NetIC2_8: IC2.8(VCF) R11.2
NetIC3_1: IC3.1(D) R1.1
NetIC3_8: IC3.8(D) R52.1
NetIC7_8: IC7.8(VCF) R53.2
NetR2_1: R2.1 R3.1 R6.2
NetR4_1: R4.1 R5.1 R7.2
NetR8_1: R8.1 R10.1 R13.2
NetR14_1: R14.1 R21.1 R27.2
NetR23_1: R23.1 R24.1 R28.2
NetR25_1: R25.1 R26.1 R33.2

Not connected (* = marked no-connect by the designer): IC2 6(VBB)* 7(VEF)* 14(~{CASC})* 15(CASC)* 17(NC)*; IC3 12(R)* 13(S)* 18(S)* 19(R)*; IC7 6(VBB)* 7(VEF)* 14(~{CASC})* 15(CASC)* 17(NC)*

### Channels
U_CHANNEL_DELAY: designators end in A; ports CLK1_N=CLK1_N CLK1_P=CLK1_P CLK2_N=CLK2_N CLK2_P=CLK2_P DELAY_LEN1=DELAY_LEN1 DELAY_LEN2=DELAY_LEN2 DIN1=DIN1 DIN2=DIN2 OUT1=NetIC1A_7 OUT2=NetIC1A_6
U_CHANNEL_DELAY: designators end in B; ports CLK1_N=CLK1_N CLK1_P=CLK1_P CLK2_N=CLK2_N CLK2_P=CLK2_P DELAY_LEN1=DELAY_LEN3 DELAY_LEN2=DELAY_LEN4 DIN1=DIN3 DIN2=DIN4 OUT1=NetIC1B_7 OUT2=NetIC1B_6

### Buses and harness runs
bus DELAY_D[9..0] = port DELAY_D[9..0]

### Layout directives
differential pair: CLK1_N, CLK1_P, CLK2_N, CLK2_P, D1_N_U_CHANNEL_DELAY, D1_P_U_CHANNEL_DELAY, D2_N_U_CHANNEL_DELAY, D2_P_U_CHANNEL_DELAY, Q1_N_U_CHANNEL_DELAY, Q1_P_U_CHANNEL_DELAY, Q2_N_U_CHANNEL_DELAY, Q2_P_U_CHANNEL_DELAY

### Notes on the sheet
- MC100LVEL input current is about 100..300uA
  In order to translate LVCMOS to LVPECL/LVDS simple resistive network can be used
- (near IC2) VCF = VEF Pin (Note 4) ECL Mode
  VCF =  No Connect LVCMOS Mode
  VCF = 1.5 V +/- 100 mV (or 2k2 resistor to GND) - LVTTL Mode (Note 5)
- (near IC3) R/S inputs are low if unconnected
- D inputs are reversed in IC7 to simplify PCB routing.
- Copyright CERN 2011, 2012.
  This documentation describes Open Hardware and is licensed under the CERN OHL v. 1.1. You may redistribute and modify this documentation under the terms of the CERN OHL v.1.1. (http://ohwr.org/CERNOHL). This documentation is distributed WITHOUT ANY EXPRESS OR IMPLIED WARRANTY, INCLUDING OF MERCHANTABILITY, SATISFACTORY QUALITY AND FITNESS FOR A PARTICULAR PURPOSE. Please see the CERN OHL v.1.1 for applicable conditions.
- Project/Equipment
- Document
- Designer
- Drawn by
- Check.by
- File
- Last Mod.
- Print Date
- Sheet
- Size
- A4
- of
- Rev
- (in symbol R0603_2K_1%_0.1W_100PPM) 1%
- (in symbol R0603_51R_1%_0.1W_100PPM) 1%

### Library data of the parts
C4 = CC0603_10NF_50V_10%_X7R: Non-polarised capacitor; Part Description: SMD Multilayer Chip Ceramic Capacitor; Manufacturer: GENERIC; Manufacturer1 Part Number: 223858615636; Voltage: 50V; TC: X7R; Tolerance: ±10%; Table: Capacitors SMD; Part Number: CC0603_10NF_50V_10%_X7R; Component Kind: Standard; Component Type: Standard; Pin Count: 2; Value: 10nF; Status: Preferred; Manufacturer Part Number: CC0603_10NF_50V_10%_X7R; Case: 0603; Mounted: Yes; Socket: No; SMD: Yes; Manufacturer1 Example: PHYCOMP; Manufacturer1 ComponentHeight: 0.87mm; HelpURL: \\cern.ch\dfs\Applications\Altium\Datasheets\CC0603_X7R_PHYCOMP.pdf; Author: CERN DEM JLC; CreateDate: 12/3/2007; LatestRevisionDate: 12/3/2007
C6-C8 C35 C36 C38 C46 C48 C71 = CC0603_100NF_50V_10%_X7R: Non-polarised capacitor; Manufacturer1 Part Number: 223858615649; Manufacturer: GENERIC; Part Description: SMD Multilayer Chip Ceramic Capacitor; Table: Capacitors SMD; TC: X7R; Tolerance: ±10%; Voltage: 50V; Author: CERN DEM JLC; Component Type: Standard; CreateDate: 12/3/2007; HelpURL: \\cern.ch\dfs\Applications\Altium\Datasheets\CC0603_X7R_PHYCOMP.pdf; LatestRevisionDate: 12/3/2007; Manufacturer1 ComponentHeight: 0.87mm; Manufacturer1 Example: PHYCOMP; Manufacturer Part Number: CC0603_100NF_50V_10%_X7R; Mounted: Yes; Pin Count: 2; SMD: Yes; Socket: No; Status: Preferred; Value: 100nF; Part Number: CC0603_100NF_50V_10%_X7R; Component Kind: Standard; Case: 0603
IC1 = SY100EPT23LZG: 3.3V Dual Differential LVPECL/LVDS/CML  to LVTTL/LVCMOS Translator; Manufacturer: MICREL; Table: Standard Logic; Part Number: SY100EPT23LZG; Component Kind: Standard; Component Type: Standard; Device: SY100EPT23LZG; PackageDescription: SOIC 8, Pitch 1.27mm - Body 4x5mm, IPC Medium Density; Part Description: 3.3V Dual Differential LVPECL/LVDS/CML To LVTTL/LVCMOS Translator; Manufacturer Part Number: SY100EPT23LZG; Pin Count: 8; Case: SOIC8; Mounted: Yes; Socket: No; SMD: Yes; ComponentHeight: 1.73mm; Author: CERN DEM JLC; HelpURL: \\cern.ch\dfs\Applications\Altium\Datasheets\SY100EPT23LZG.pdf; CreateDate: 1/17/2011; LatestRevisionDate: 1/17/2011
IC2 IC7 = SY89295UMG: 2.5V/3.3V 1.5GHz Precision LVPECL Programmable Delay; Manufacturer: MICREL; Table: Analog & Interface; Part Number: SY89295UMG; Component Kind: Standard; Component Type: Standard; Device: SY89295UMG; PackageDescription: QFN, (MO-220-VHHD-4) 0.50mm pitch,square; 8 pin X 8 pin, 5mm X 5mm X 1.00mm H body (w/thermal tab 3.2 X 3.2mm),  IPC Medium Density; Part Description: 2.5V/3.3V 1.5GHz Precision LVPECL Programmable Delay; Manufacturer Part Number: SY89295UMG; Pin Count: 32; Case: QFN32; Mounted: Yes; Socket: No; SMD: Yes; ComponentHeight: 1mm; Author: CERN DEM JLC; HelpURL: \\cern.ch\dfs\Applications\Altium\Datasheets\SY89295UMG.pdf; CreateDate: 5/4/2011; LatestRevisionDate: 5/4/2011
IC3 = MC100EP29DTG: 3.3V/5V ECL Dual Differential Data and Clock D Flip-Flop With Set and Reset; Manufacturer: ON SEMICONDUCTOR; Table: Standard Logic; Part Number: MC100EP29DTG; Component Kind: Standard; Component Type: Standard; Device: MC100EP29DTG; PackageDescription: SOP, 20-Leads, Body 6.5x4.4mm, Pitch 0.65mm, IPC Medium Density; Part Description: 3.3V/5V ECL Dual Differential Data And Clock D Flip-Flop With Set and Reset; Manufacturer Part Number: MC100EP29DTG; Pin Count: 20; Case: TSSOP20; Mounted: Yes; Socket: No; SMD: Yes; ComponentHeight: 1.2mm; Author: CERN DEM JLC; HelpURL: \\cern.ch\dfs\Applications\Altium\Datasheets\MC100EP29DTG.pdf; CreateDate: 1/12/2011; LatestRevisionDate: 1/12/2011
R1-R8 R10 R13 R14 R21 R23-R28 R33 R52 = R0603_51R_1%_0.1W_100PPM: Resistor - 1%; Part Description: General Purpose Thick Film Chip Resistor; Manufacturer: GENERIC; Manufacturer1 Part Number: NRC06F51R0TRF; Power: 0.1W; TC: ±100ppm/°C; Table: Resistors SMD; Part Number: R0603_51R_1%_0.1W_100PPM; Component Kind: Standard; Component Type: Standard; Pin Count: 2; Value: 51; Status: Preferred; Tolerance: ±1%; Manufacturer Part Number: R0603_51R_1%_0.1W_100PPM; Case: 0603; Mounted: Yes; Socket: No; SMD: Yes; Manufacturer1 Example: NIC COMPONENT; Manufacturer1 ComponentHeight: 0.55mm; HelpURL: \\cern.ch\dfs\Applications\Altium\Datasheets\R0603_NIC_NRC.pdf; Author: CERN DEM JLC; CreateDate: 12/3/2007; LatestRevisionDate: 3/13/2008
R11 R53 = R0603_2K_1%_0.1W_100PPM: Resistor - 1%; Part Description: General Purpose Thick Film Chip Resistor; Manufacturer: GENERIC; Manufacturer1 Part Number: NRC06F2001TRF; Power: 0.1W; TC: ±100ppm/°C; Table: Resistors SMD; Part Number: R0603_2K_1%_0.1W_100PPM; Component Kind: Standard; Component Type: Standard; Pin Count: 2; Value: 2k; Status: Preferred; Tolerance: ±1%; Manufacturer Part Number: R0603_2K_1%_0.1W_100PPM; Case: 0603; Mounted: Yes; Socket: No; SMD: Yes; Manufacturer1 Example: NIC COMPONENT; Manufacturer1 ComponentHeight: 0.55mm; HelpURL: \\cern.ch\dfs\Applications\Altium\Datasheets\R0603_NIC_NRC.pdf; Author: CERN DEM JLC; CreateDate: 12/3/2007; LatestRevisionDate: 3/13/2008

## Sheet output_driver.SchDoc: Fine Delay FMC
size 297 x 209 mm; CheckedBy: B. Civel; CompanyName: CERN; DrawnBy: TW, GK; Engineer: TW; Organization: CERN; Address1: European Organization for Nuclear Research; Address2: CH-1211 Geneve 23 - Switzerland; DocumentNumber: 9; Revision: -; SheetNumber: 9; SheetTotal: 10; ModifiedBy: B. Civel; CreateDate: 01/12/2011; CheckedDate: 06/06/2013; Title2: Output buffer/driver (all channels); DivGrp: BE-CO; Designer: TW, GK; EDA_Number: EDA-02267-V6-1; Projet: Fine Delay FMC (FMCDel1ns4cha); ModifiedDate: 16/08/2012
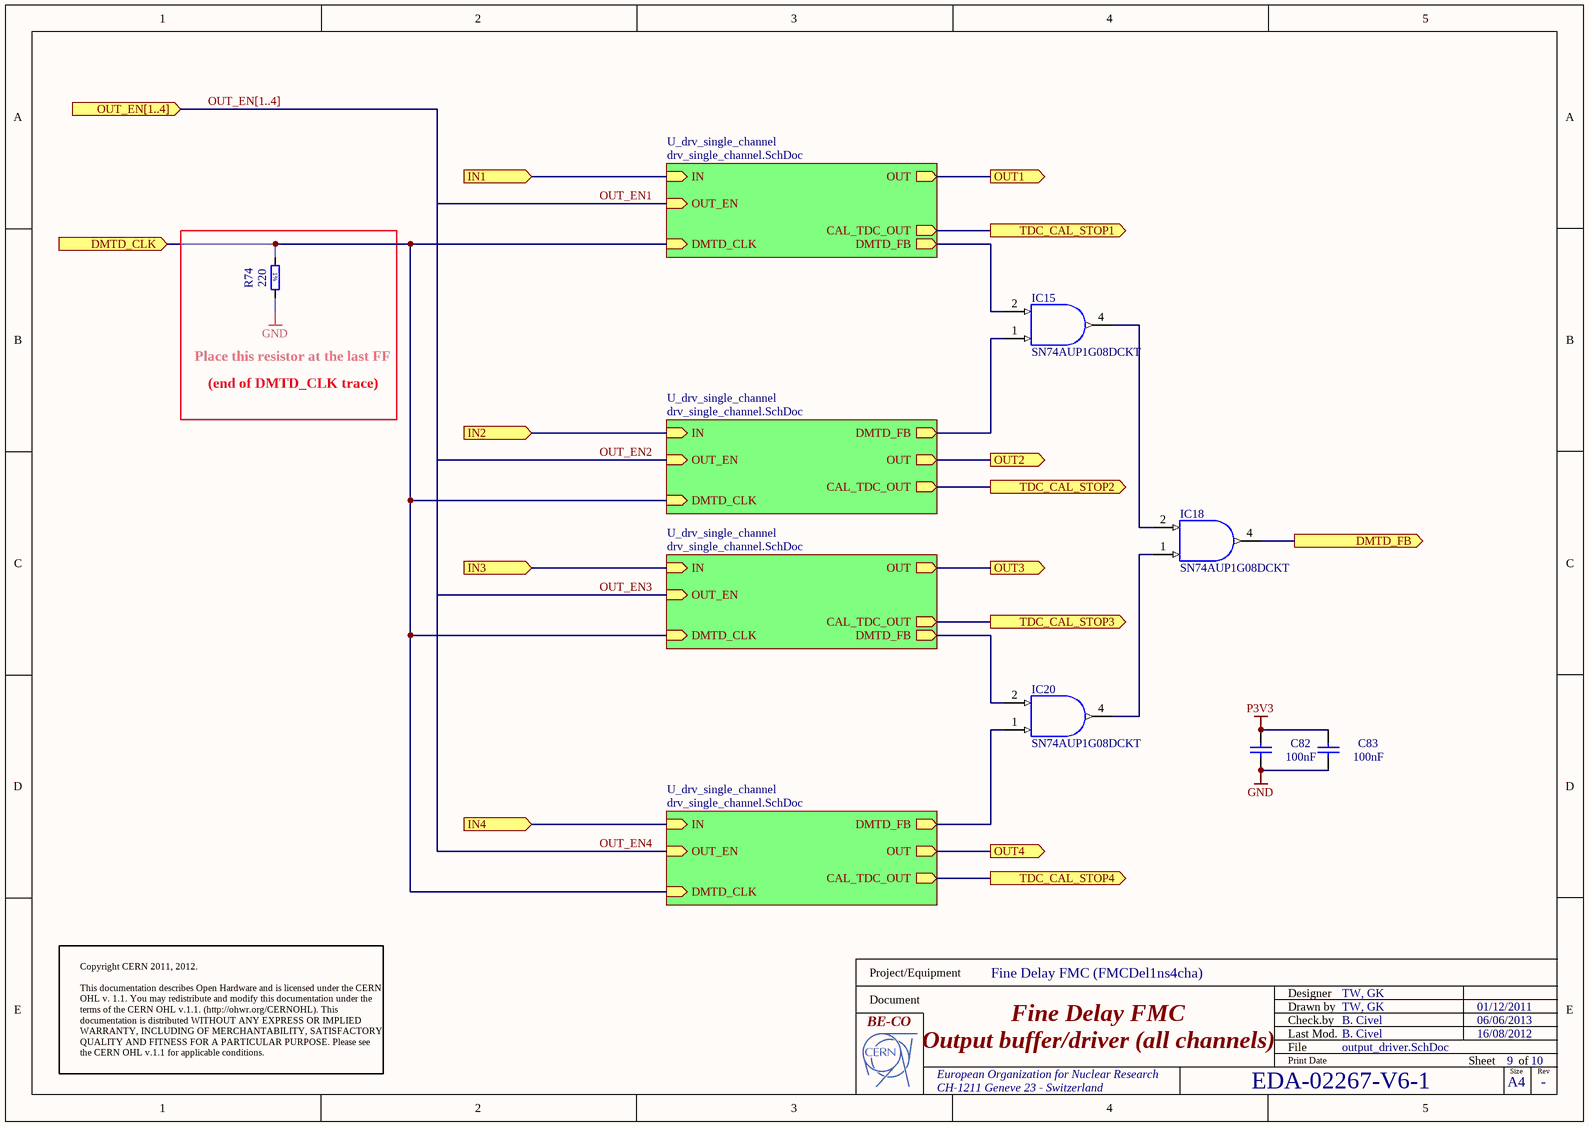
[diagram p6: output_driver.SchDoc]

### Parts
C82  100nF  [CAPC1608X87N]
C83  100nF  [CAPC1608X87N]
IC15  SN74AUP1G08DCKT  [SOT65P210X110-5N]
IC18  SN74AUP1G08DCKT  [SOT65P210X110-5N]
IC20  SN74AUP1G08DCKT  [SOT65P210X110-5N]
R74  220  [RESC1608X55N]

### Sub-sheets
U_drv_single_channel = drv_single_channel.SchDoc: IN (in), OUT (out), OUT_EN (in), CAL_TDC_OUT (out), DMTD_FB (out), DMTD_CLK (in)
U_drv_single_channel = drv_single_channel.SchDoc: IN (in), OUT (out), OUT_EN (in), CAL_TDC_OUT (out), DMTD_FB (out), DMTD_CLK (in)
U_drv_single_channel = drv_single_channel.SchDoc: IN (in), OUT (out), OUT_EN (in), CAL_TDC_OUT (out), DMTD_FB (out), DMTD_CLK (in)
U_drv_single_channel = drv_single_channel.SchDoc: IN (in), OUT (out), OUT_EN (in), CAL_TDC_OUT (out), DMTD_FB (out), DMTD_CLK (in)

### Ports
DMTD_CLK (in), DMTD_FB (out), IN1 (in), IN2 (in), IN3 (in), IN4 (in), OUT1 (out), OUT2 (out), OUT3 (out), OUT4 (out), OUT_EN[1..4] (in), TDC_CAL_STOP1 (out), TDC_CAL_STOP2 (out), TDC_CAL_STOP3 (out), TDC_CAL_STOP4 (out)

### Nets
GND: C82.2 C83.2 IC15.3(GND) IC18.3(GND) IC20.3(GND) R74.2
P3V3: C82.1 C83.1 IC15.5(VCC) IC18.5(VCC) IC20.5(VCC)
DMTD_CLK_BUF: R74.1 ; port DMTD_CLK, sheet U_drv_single_channel/DMTD_CLK, sheet U_drv_single_channel/DMTD_CLK, sheet U_drv_single_channel/DMTD_CLK, sheet U_drv_single_channel/DMTD_CLK
DMTD_FB_OUT: IC18.4(Y) ; port DMTD_FB
TDC_CAL_STOP1: port TDC_CAL_STOP1, sheet U_drv_single_channel/CAL_TDC_OUT
TDC_CAL_STOP2: port TDC_CAL_STOP2, sheet U_drv_single_channel/CAL_TDC_OUT
TDC_CAL_STOP3: port TDC_CAL_STOP3, sheet U_drv_single_channel/CAL_TDC_OUT
TDC_CAL_STOP4: port TDC_CAL_STOP4, sheet U_drv_single_channel/CAL_TDC_OUT
NetIC1A_6: port IN3, sheet U_drv_single_channel/IN
NetIC1A_7: port IN4, sheet U_drv_single_channel/IN
NetIC1B_6: port IN1, sheet U_drv_single_channel/IN
NetIC1B_7: port IN2, sheet U_drv_single_channel/IN
NetIC15_1: IC15.1(B) ; sheet U_drv_single_channel/DMTD_FB
NetIC15_2: IC15.2(A) ; sheet U_drv_single_channel/DMTD_FB
NetIC15_4: IC15.4(Y) IC18.2(A)
NetIC18_1: IC18.1(B) IC20.4(Y)
NetIC20_1: IC20.1(B) ; sheet U_drv_single_channel/DMTD_FB
NetIC20_2: IC20.2(A) ; sheet U_drv_single_channel/DMTD_FB
NetJ1_1: port OUT1, sheet U_drv_single_channel/OUT
NetJ2_1: port OUT2, sheet U_drv_single_channel/OUT
NetJ3_1: port OUT3, sheet U_drv_single_channel/OUT
NetJ4_1: port OUT4, sheet U_drv_single_channel/OUT

### Buses and harness runs
bus OUT_EN[1..4] = port OUT_EN[1..4]

### Notes on the sheet
- Place this resistor at the last FF
- (end of DMTD_CLK trace)
- Copyright CERN 2011, 2012.
  This documentation describes Open Hardware and is licensed under the CERN OHL v. 1.1. You may redistribute and modify this documentation under the terms of the CERN OHL v.1.1. (http://ohwr.org/CERNOHL). This documentation is distributed WITHOUT ANY EXPRESS OR IMPLIED WARRANTY, INCLUDING OF MERCHANTABILITY, SATISFACTORY QUALITY AND FITNESS FOR A PARTICULAR PURPOSE. Please see the CERN OHL v.1.1 for applicable conditions.
- Project/Equipment
- Document
- Designer
- Drawn by
- Check.by
- File
- Last Mod.
- Print Date
- Sheet
- Size
- A4
- of
- Rev
- (in symbol R0603_220R_1%_0.1W_100PPM) 1%

### Library data of the parts
C82 C83 = CC0603_100NF_50V_10%_X7R: Non-polarised capacitor; Part Description: SMD Multilayer Chip Ceramic Capacitor; Manufacturer: GENERIC; Manufacturer1 Part Number: 223858615649; Voltage: 50V; TC: X7R; Tolerance: ±10%; Table: Capacitors SMD; Part Number: CC0603_100NF_50V_10%_X7R; Component Kind: Standard; Component Type: Standard; Pin Count: 2; Value: 100nF; Status: Preferred; Manufacturer Part Number: CC0603_100NF_50V_10%_X7R; Case: 0603; Mounted: Yes; Socket: No; SMD: Yes; Manufacturer1 Example: PHYCOMP; Manufacturer1 ComponentHeight: 0.87mm; HelpURL: \\cern.ch\dfs\Applications\Altium\Datasheets\CC0603_X7R_PHYCOMP.pdf; Author: CERN DEM JLC; CreateDate: 03/12/2007; LatestRevisionDate: 03/12/2007
IC15 IC18 IC20 = SN74AUP1G08DCKT: Single 2-Input AND Gate; Part Description: Low-Power Single 2-Input AND Gate; Manufacturer: TEXAS INSTRUMENTS; Table: Standard Logic; PressFit: No; Bonding: No; Part Number: SN74AUP1G08DCKT; Component Kind: Standard; Component Type: Standard; Device: SN74AUP1G08DCKT; PackageDescription: SOT353, SC70-5, SOT, 0.65mm Pitch, 5 pin, 1.25mm W X 2.00mm L X 1.10mm H, IPC Medium Density; Manufacturer Part Number: SN74AUP1G08DCKT; Pin Count: 5; Case: SOT353; Mounted: Yes; Socket: No; SMD: Yes; ComponentHeight: 1.1mm; Author: CERN DEM JLC; HelpURL: \\cern.ch\dfs\Applications\Altium\Datasheets\SN74AUP1G08DCKT.pdf; CreateDate: 19/12/2011; LatestRevisionDate: 19/12/2011
R74 = R0603_220R_1%_0.1W_100PPM: Resistor - 1%; Part Description: General Purpose Thick Film Chip Resistor; Manufacturer: GENERIC; Manufacturer1 Part Number: NRC06F2200TRF; Power: 0.1W; TC: ±100ppm/°C; Table: Resistors SMD; Part Number: R0603_220R_1%_0.1W_100PPM; Component Kind: Standard; Component Type: Standard; Pin Count: 2; Value: 220; Status: Preferred; Tolerance: ±1%; Manufacturer Part Number: R0603_220R_1%_0.1W_100PPM; Case: 0603; Mounted: Yes; Socket: No; SMD: Yes; Manufacturer1 Example: NIC COMPONENT; Manufacturer1 ComponentHeight: 0.55mm; HelpURL: \\cern.ch\dfs\Applications\Altium\Datasheets\R0603_NIC_NRC.pdf; Author: CERN DEM JLC; CreateDate: 12/3/2007; LatestRevisionDate: 3/13/2008